# Altium project Audio module.PrjPcb
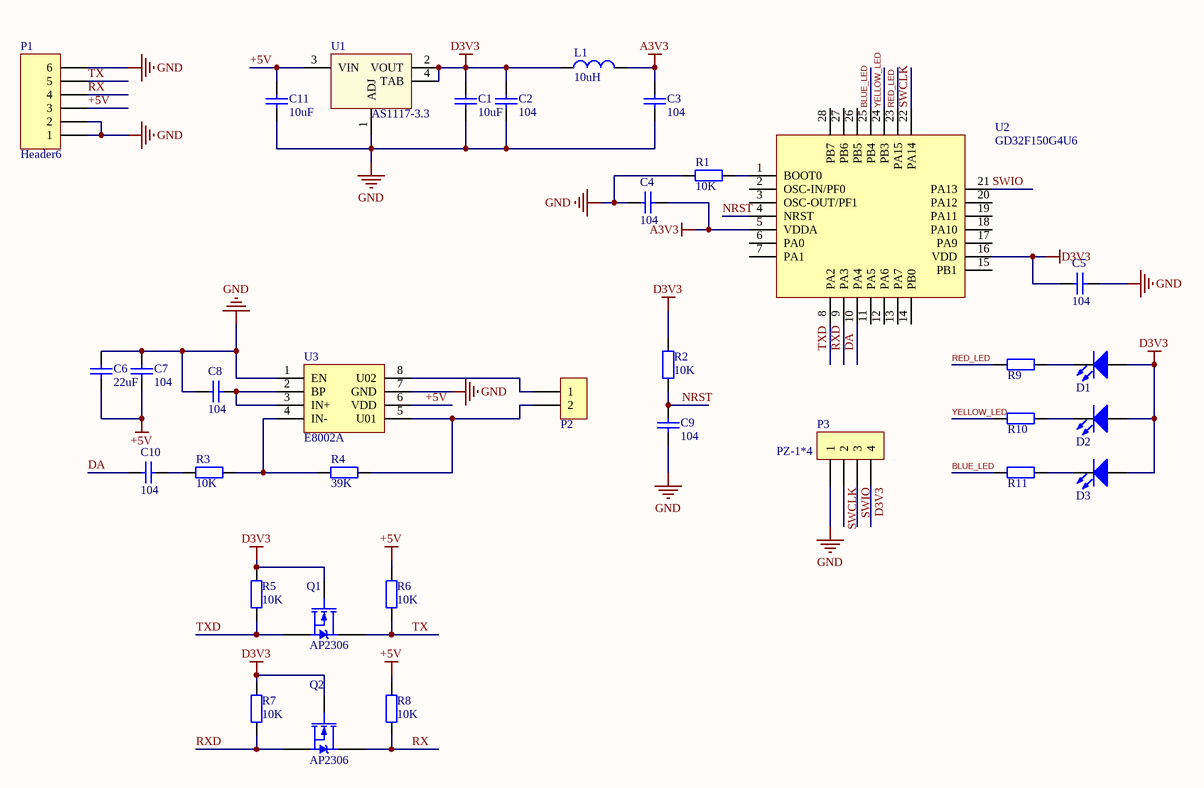
[diagram p0: Audio module.SchDoc]
1 sheet, 34 parts. Net scope: global (net labels, ports and power ports of the same name join across sheets).
Board file: Audio module.PcbDoc

## Sheet Audio module.SchDoc
size A4

### Parts
C1  value 10uF  [0603-2]  (hidden comment: Cap)
C2  value 104  [0603-2]  (hidden comment: Cap)
C3  value 104  [0603-2]  (hidden comment: Cap)
C4  value 104  [0603-2]  (hidden comment: Cap)
C5  value 104  [0603-2]  (hidden comment: Cap)
C6  value 22uF  [0603-2]  (hidden comment: Cap)
C7  value 104  [0603-2]  (hidden comment: Cap)
C8  value 104  [0603-2]  (hidden comment: Cap)
C9  value 104  [0603-2]  (hidden comment: Cap)
C10  value 104  [0603-2]  (hidden comment: Cap)
C11  value 10uF  [0603-2]  (hidden comment: Cap)
D1  RED_LED  [RES_0603]  (value not drawn)
D2  YELLOW_LED  [RES_0603]  (value not drawn)
D3  BLUE_LED  [RES_0603]  (value not drawn)
L1  value 10uH  [0805-1]  (hidden comment: Inductor)
P1  Header6  [HDR6X1_A]
P2  PZ-1*2  [HDR2X1_A]  (value not drawn)
P3  PZ-1*4  [HDR4X1_A]
Q1  AP2306  [SOT-23]
Q2  AP2306  [SOT-23]
R1  10K  [RES-0603]
R2  10K  [RES-0603]
R3  value 10K  [0603-1]  (hidden comment: Res1)
R4  value 39K  [0603-1]  (hidden comment: Res1)
R5  10K  [RES-0603]
R6  10K  [RES-0603]
R7  10K  [RES-0603]
R8  10K  [RES-0603]
R9  RES  [RES_0603]  (value not drawn)
R10  RES  [RES_0603]  (value not drawn)
R11  RES  [RES_0603]  (value not drawn)
U1  AS1117-3.3  [SOT-223]
U2  GD32F150G4U6  [QFN28-1]
U3  E8002A  [SOP-8]

### Nets
+5V: C6.2 C7.1 C11.2 P1.3 R6.2 R8.2 U1.3(VIN) U3.6(VDD)
A3V3: C3.2 C4.1 L1.2 U2.5(VDDA)
D3V3: C1.2 C2.2 C5.2 D1.1(A) D2.1(A) D3.1(A) L1.1 P3.4 R2.2 R5.2 R7.2 U1.2(VOUT) U1.4(TAB) U2.16(VDD)
GND: C1.1 C2.1 C3.1 C4.2 C5.1 C6.1 C7.2 C8.2 C9.1 C11.1 P1.1 P1.2 P1.6 P3.1 R1.2 U1.1(ADJ) U3.1(EN) U3.7(GND)
BLUE_LED: R11.1 U2.25(PB4)
DA: C10.2 U2.10(PA4)
NRST: C9.2 R2.1 U2.4(NRST)
RED_LED: R9.1 U2.23(PA15)
RX: P1.4 Q2.3(D) R8.1
RXD: Q2.2(S) R7.1 U2.9(PA3)
SWCLK: P3.2 U2.22(PA14)
SWIO: P3.3 U2.21(PA13)
TX: P1.5 Q1.3(D) R6.1
TXD: Q1.2(S) R5.1 U2.8(PA2)
YELLOW_LED: R10.1 U2.24(PB3)
NetC8_1: C8.1 U3.2(BP) U3.3(IN+)
NetC10_1: C10.1 R3.1
NetD1_2: D1.2(K) R9.2
NetD2_2: D2.2(K) R10.2
NetD3_2: D3.2(K) R11.2
NetP2_1: P2.1 U3.8(U02)
NetP2_2: P2.2 R4.2 U3.5(U01)
NetR1_1: R1.1 U2.1(BOOT0)
NetR3_2: R3.2 R4.1 U3.4(IN-)

Not connected (* = marked no-connect by the designer): Q1 G(1); Q2 G(1); U2 2(OSC-IN/PF0) 3(OSC-OUT/PF1) 6(PA0) 7(PA1) 11(PA5) 12(PA6) 13(PA7) 14(PB0) 15(PB1) 17(PA9) 18(PA10) 19(PA11) 20(PA12) 26(PB5) 27(PB6) 28(PB7)

### Library data of the parts
C1-C11 = Cap: 无极性电容; Published: 8-Jun-2000; LatestRevisionDate: 17-Jul-2002; LatestRevisionNote: Re-released for DXP Platform.; PackageReference: RAD-0.3; Publisher: Altium Limited
D1-D3 = LED
L1 = Inductor: 电感; Code_IEC: 1005; Published: 8-Jun-2000; LatestRevisionDate: 17-Jul-2002; LatestRevisionNote: Re-released for DXP Platform.; PackageReference: 0402-A; Publisher: Altium Limited; Code_JEITA: 0402
Q1 Q2 = MOSFET-N1: N-MOSFET1; PackageDocument: 1995/1996; Published: 8-Jun-2000; LatestRevisionDate: 17-Jul-2002; LatestRevisionNote: Re-released for DXP Platform.; PackageReference: E3; Publisher: Altium Limited
R1-R8 = Res1: 贴片电阻; Published: 8-Jun-2000; LatestRevisionDate: 17-Jul-2002; LatestRevisionNote: Re-released for DXP Platform.; PackageReference: AXIAL-0.4; Publisher: Altium Limited
  R1 R2 R5-R8: Value: 10K
R9-R11 = RES: value: 1K
U1 = AS1117